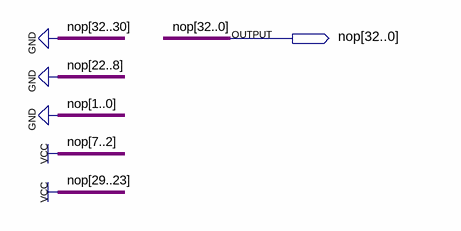
[diagram p0: schematic sheet]
// Quartus schematic microinstruction_nop.bdf as structural Verilog: 0 symbols, 1 pins
module microinstruction_nop (
  output [32:0] nop
);


  assign nop = 33'b000111111100000000000000011111100;
endmodule
